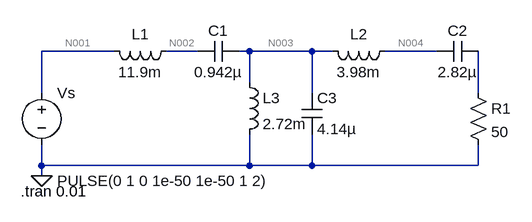
[diagram p0: schematic (2)ButBPF.asc]
(2)ButBPF.asc, the LTspice schematic file:
Version 4
SHEET 1 880 680
WIRE 112 48 0 48
WIRE 240 48 192 48
WIRE 320 48 304 48
WIRE 416 48 320 48
WIRE 448 48 416 48
WIRE 608 48 528 48
WIRE 320 96 320 48
WIRE 0 112 0 48
WIRE 416 112 416 48
WIRE 672 112 672 48
WIRE 0 224 0 192
WIRE 320 224 320 176
WIRE 320 224 0 224
WIRE 416 224 416 176
WIRE 416 224 320 224
WIRE 672 224 672 192
WIRE 672 224 416 224
WIRE 0 240 0 224
FLAG 0 240 0
SYMBOL voltage 0 96 R0
WINDOW 123 24 124 Left 2
WINDOW 39 0 0 Left 2
WINDOW 3 24 152 Left 2
SYMATTR InstName Vs
SYMATTR Value PULSE(0 1 0 1e-50 1e-50 1 2)
SYMBOL ind 208 32 R90
WINDOW 0 5 56 VBottom 2
WINDOW 3 32 56 VTop 2
SYMATTR InstName L1
SYMATTR Value 11.9m
SYMBOL ind 544 32 R90
WINDOW 0 5 56 VBottom 2
WINDOW 3 32 56 VTop 2
SYMATTR InstName L2
SYMATTR Value 3.98m
SYMBOL res 656 96 R0
SYMATTR InstName R1
SYMATTR Value 50
SYMBOL cap 400 112 R0
SYMATTR InstName C3
SYMATTR Value 4.14µ
SYMBOL cap 304 32 R90
WINDOW 0 0 32 VBottom 2
WINDOW 3 32 32 VTop 2
SYMATTR InstName C1
SYMATTR Value 0.942µ
SYMBOL ind 304 80 R0
SYMATTR InstName L3
SYMATTR Value 2.72m
SYMBOL cap 672 32 R90
WINDOW 0 0 32 VBottom 2
WINDOW 3 32 32 VTop 2
SYMATTR InstName C2
SYMATTR Value 2.82µ
TEXT -32 264 Left 2 !.tran 0.01

The netlist it stands for:
* (2)ButBPF.asc
Vs N001 0 PULSE(0 1 0 1e-50 1e-50 1 2)
L1 N002 N001 11.9m
L2 N004 N003 3.98m
R1 N005 0 50
C3 N003 0 4.14µ
C1 N003 N002 0.942µ
L3 N003 0 2.72m
C2 N005 N004 2.82µ
.tran 0.01
.backanno
.end

* Results of the author's LTspice run, read from the files saved beside the schematic
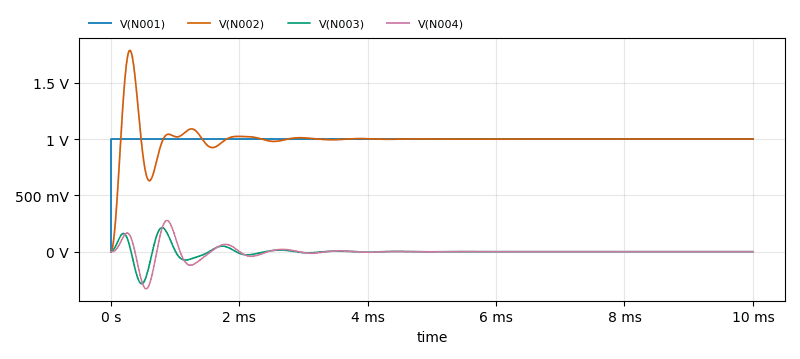
[diagram p1: Transient Analysis of (2)ButBPF.asc, plotted from the saved traces]
* Transient Analysis, 1 run:
*   V(N001): min 0 V, max 1 V, average 1 V, rms 1 V, last 1 V
*   V(N002): min 0 V, max 1.787 V, average 1 V, rms 1.01 V, last 1 V
*   V(N003): min -284.8 mV, max 213 mV, average -1.741 µV, rms 51.5 mV, last 2.777 µV
*   V(N004): min -329.3 mV, max 276.7 mV, average -484.9 nV, rms 63.07 mV, last 4.898 µV